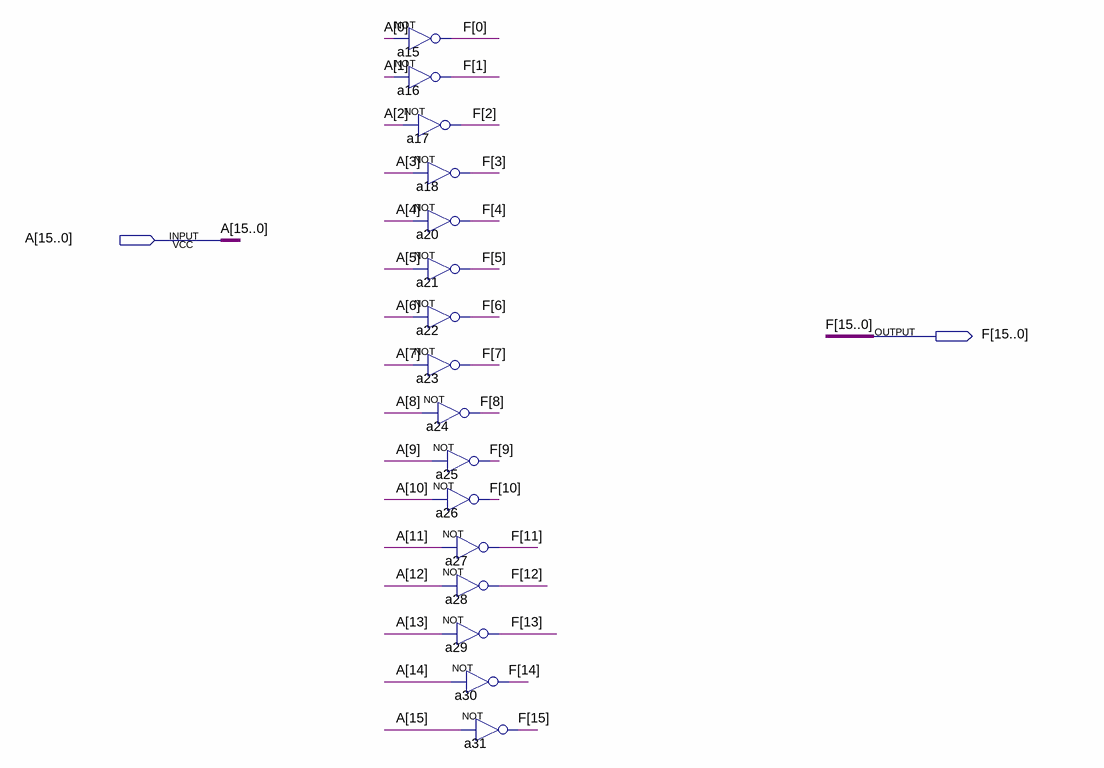
[diagram p0: schematic sheet]
// Quartus schematic 16BITnot.bdf as structural Verilog: 16 symbols, 2 pins
module \16BITnot  (
  input  [15:0] A,
  output [15:0] F
);

  not a15 (F[0], A[0]);
  not a16 (F[1], A[1]);
  not a17 (F[2], A[2]);
  not a18 (F[3], A[3]);
  not a20 (F[4], A[4]);
  not a21 (F[5], A[5]);
  not a22 (F[6], A[6]);
  not a23 (F[7], A[7]);
  not a24 (F[8], A[8]);
  not a25 (F[9], A[9]);
  not a26 (F[10], A[10]);
  not a27 (F[11], A[11]);
  not a28 (F[12], A[12]);
  not a29 (F[13], A[13]);
  not a30 (F[14], A[14]);
  not a31 (F[15], A[15]);
endmodule
